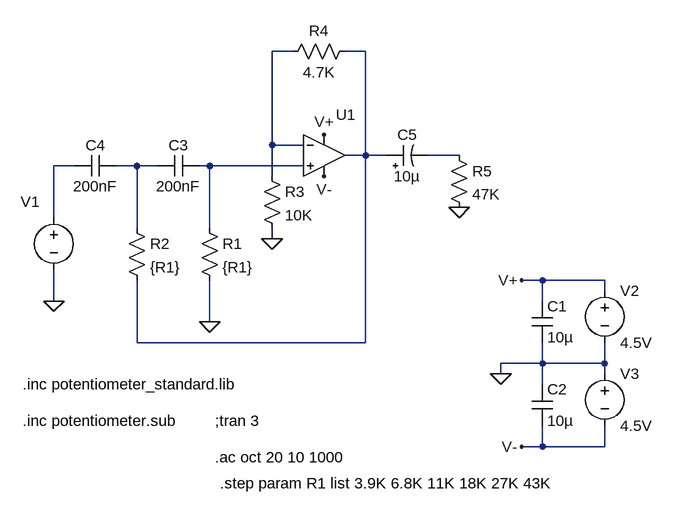
[diagram p0: schematic dualpre_calc_hipass.asc]
dualpre_calc_hipass.asc, the LTspice schematic file:
Version 4
SHEET 1 1304 812
WIRE 176 -32 144 -32
WIRE 288 -32 256 -32
WIRE 144 112 144 -32
WIRE 192 112 144 112
WIRE 288 128 288 -32
WIRE 288 128 256 128
WIRE 320 128 288 128
WIRE 432 128 384 128
WIRE -160 144 -192 144
WIRE -64 144 -96 144
WIRE -32 144 -64 144
WIRE 48 144 32 144
WIRE 192 144 48 144
WIRE 144 160 144 112
WIRE -192 224 -192 144
WIRE -64 240 -64 144
WIRE 48 240 48 144
WIRE 144 256 144 240
WIRE 560 320 528 320
WIRE 656 320 560 320
WIRE 656 336 656 320
WIRE -192 352 -192 304
WIRE 560 352 560 320
WIRE 48 384 48 320
WIRE -64 416 -64 320
WIRE 288 416 288 128
WIRE 288 416 -64 416
WIRE 560 448 560 416
WIRE 560 448 496 448
WIRE 656 448 656 416
WIRE 656 448 560 448
WIRE 496 464 496 448
WIRE 656 464 656 448
WIRE 560 480 560 448
WIRE 560 576 560 544
WIRE 560 576 528 576
WIRE 656 576 656 544
WIRE 656 576 560 576
FLAG 496 464 0
FLAG 528 320 V+
FLAG 528 576 V-
FLAG 224 160 V-
FLAG 224 96 V+
FLAG 144 256 0
FLAG 48 384 0
FLAG 432 208 0
FLAG -192 352 0
SYMBOL voltage -192 208 R0
WINDOW 39 -112 95 Left 2
WINDOW 3 24 96 Invisible 2
WINDOW 0 -51 -9 Left 2
SYMATTR Value SINE(0 0.1V 10000)
SYMATTR InstName V1
SYMATTR Value2 AC 1
SYMBOL voltage 656 320 R0
WINDOW 123 0 0 Left 2
WINDOW 39 0 0 Left 2
SYMATTR InstName V2
SYMATTR Value 4.5V
SYMBOL cap 544 352 R0
SYMATTR InstName C1
SYMATTR Value 10µ
SYMBOL cap 544 480 R0
SYMATTR InstName C2
SYMATTR Value 10µ
SYMBOL Opamps\\UniversalOpamp2 224 128 R0
WINDOW 0 18 -63 Left 2
SYMATTR InstName U1
SYMBOL res 32 224 R0
SYMATTR InstName R1
SYMATTR Value {R1}
SYMBOL res -80 224 R0
SYMATTR InstName R2
SYMATTR Value {R1}
SYMBOL res 128 144 R0
SYMATTR InstName R3
SYMATTR Value 10K
SYMBOL res 272 -48 R90
WINDOW 0 0 56 VBottom 2
WINDOW 3 32 56 VTop 2
SYMATTR InstName R4
SYMATTR Value 4.7K
SYMBOL cap 32 128 R90
WINDOW 0 0 32 VBottom 2
WINDOW 3 32 32 VTop 2
SYMATTR InstName C3
SYMATTR Value 200nF
SYMBOL cap -96 128 R90
WINDOW 0 0 32 VBottom 2
WINDOW 3 32 32 VTop 2
SYMATTR InstName C4
SYMATTR Value 200nF
SYMBOL polcap 320 144 R270
WINDOW 0 32 32 VTop 2
WINDOW 3 0 32 VBottom 2
SYMATTR InstName C5
SYMATTR Value 10µ
SYMBOL res 416 112 R0
SYMATTR InstName R5
SYMATTR Value 47K
SYMBOL voltage 656 448 R0
WINDOW 123 0 0 Left 2
WINDOW 39 0 0 Left 2
SYMATTR InstName V3
SYMATTR Value 4.5V
TEXT 56 536 Left 2 !;tran 3
TEXT 56 592 Left 2 !.ac oct 20 10 1000
TEXT -240 536 Left 2 !.inc potentiometer.sub
TEXT -240 480 Left 2 !.inc potentiometer_standard.lib
TEXT 64 632 Left 2 !.step param R1 list 3.9K 6.8K 11K 18K 27K 43K

The netlist it stands for:
* dualpre_calc_hipass.asc
V1 N004 0 SINE(0 0.1V 10000) AC 1
V2 V+ 0 4.5V
C1 V+ 0 10µ
C2 0 V- 10µ
XU1 N006 N001 V+ V- N002 level.2 Avol=1Meg GBW=10Meg Slew=10Meg ilimit=25m rail=0 Vos=0 phimargin=45 en=0 enk=0 in=0 ink=0 Rin=500Meg  ; pins IN+ IN- V+ V- OUT
R1 N006 0 {R1}
R2 N005 N002 {R1}
R3 N001 0 10K
R4 N002 N001 4.7K
C3 N006 N005 200nF
C4 N005 N004 200nF
C5 N002 N003 10µ
R5 N003 0 47K
V3 0 V- 4.5V
;tran 3
.ac oct 20 10 1000
.inc potentiometer.sub
.inc potentiometer_standard.lib
.step param R1 list 3.9K 6.8K 11K 18K 27K 43K
.lib UniversalOpamps2.sub
.backanno
.end